# Altium project TSOP1738_BOARD.PrjPcb
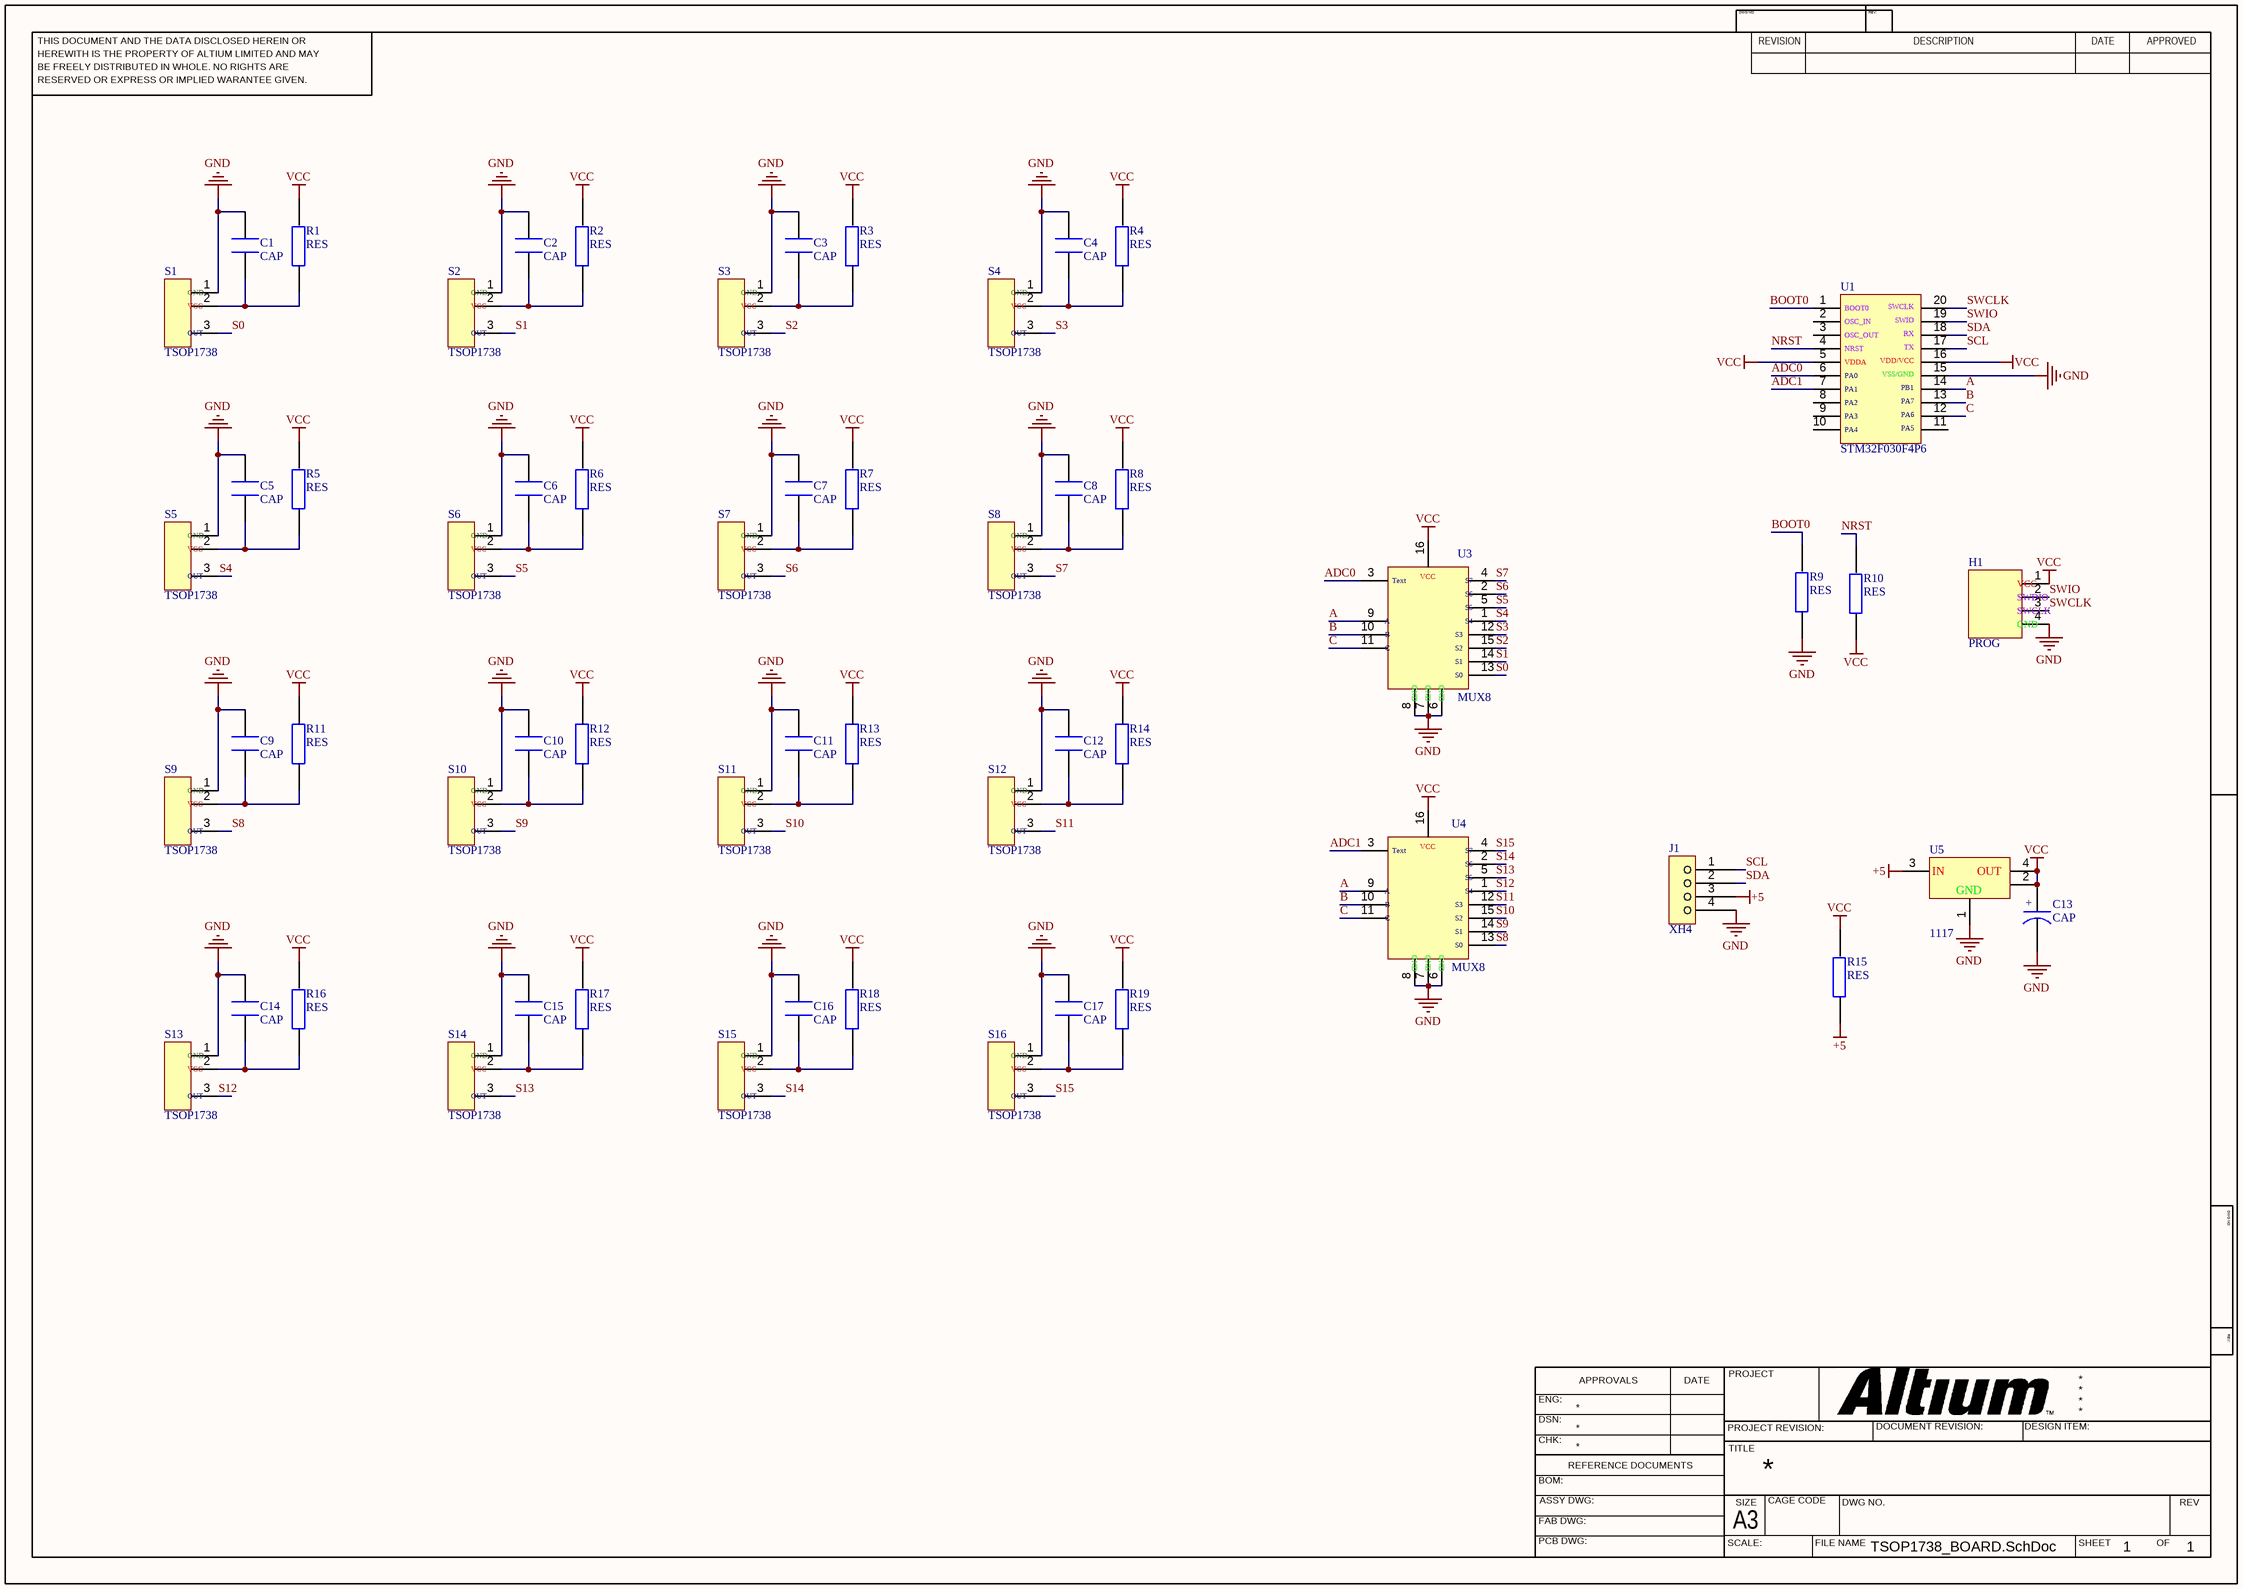
[diagram p0: TSOP1738_BOARD.SchDoc]
1 sheet, 58 parts. Net scope: global (net labels, ports and power ports of the same name join across sheets).
Board file: TSOP1738_BOARD.PcbDoc

## Sheet TSOP1738_BOARD.SchDoc
size 420 x 297 mm; SheetNumber: 1; SheetTotal: 1

### Parts
C1  CAP  [CAP1206]
C2  CAP  [CAP1206]
C3  CAP  [CAP1206]
C4  CAP  [CAP1206]
C5  CAP  [CAP1206]
C6  CAP  [CAP1206]
C7  CAP  [CAP1206]
C8  CAP  [CAP1206]
C9  CAP  [CAP1206]
C10  CAP  [CAP1206]
C11  CAP  [CAP1206]
C12  CAP  [CAP1206]
C13  CAP  [CAP SMD 100uF 16V]
C14  CAP  [CAP1206]
C15  CAP  [CAP1206]
C16  CAP  [CAP1206]
C17  CAP  [CAP1206]
H1  PROG  [PROGRAMER]
J1  XH4  [XH 4PIN]
R1  RES  [RES805]
R2  RES  [RES805]
R3  RES  [RES805]
R4  RES  [RES805]
R5  RES  [RES805]
R6  RES  [RES805]
R7  RES  [RES805]
R8  RES  [RES805]
R9  RES  [RES1206]
R10  RES  [RES1206]
R11  RES  [RES805]
R12  RES  [RES805]
R13  RES  [RES805]
R14  RES  [RES805]
R15  RES  [RES805]
R16  RES  [RES805]
R17  RES  [RES805]
R18  RES  [RES805]
R19  RES  [RES805]
S1  TSOP1738  [TSOP1738]
S2  TSOP1738  [TSOP1738]
S3  TSOP1738  [TSOP1738]
S4  TSOP1738  [TSOP1738]
S5  TSOP1738  [TSOP1738]
S6  TSOP1738  [TSOP1738]
S7  TSOP1738  [TSOP1738]
S8  TSOP1738  [TSOP1738]
S9  TSOP1738  [TSOP1738]
S10  TSOP1738  [TSOP1738]
S11  TSOP1738  [TSOP1738]
S12  TSOP1738  [TSOP1738]
S13  TSOP1738  [TSOP1738]
S14  TSOP1738  [TSOP1738]
S15  TSOP1738  [TSOP1738]
S16  TSOP1738  [TSOP1738]
U1  STM32F030F4P6  [STM32F030F4P6]
U3  MUX8  [4051 SMD]
U4  MUX8  [4051 SMD]
U5  1117  [AMS1117]

### Nets
+5: J1.3 R15.1 U5.3
GND: C1.2 C2.2 C3.2 C4.2 C5.2 C6.2 C7.2 C8.2 C9.2 C10.2 C11.2 C12.2 C13.1 C14.2 C15.2 C16.2 C17.2 H1.4 J1.4 R9.1 S1.1 S2.1 S3.1 S4.1 S5.1 S6.1 S7.1 S8.1 S9.1 S10.1 S11.1 S12.1 S13.1 S14.1 S15.1 S16.1 U1.15 U3.6 U3.7 U3.8 U4.6 U4.7 U4.8 U5.1
VCC: C13.2 H1.1 R1.2 R2.2 R3.2 R4.2 R5.2 R6.2 R7.2 R8.2 R10.1 R11.2 R12.2 R13.2 R14.2 R15.2 R16.2 R17.2 R18.2 R19.2 U1.5 U1.16 U3.16 U4.16 U5.2 U5.4
A: U1.14 U3.9 U4.9
ADC0: U1.6 U3.3
ADC1: U1.7 U4.3
B: U1.13 U3.10 U4.10
BOOT0: R9.2 U1.1
C: U1.12 U3.11 U4.11
NRST: R10.2 U1.4
S0: S1.3 U3.13
S1: S2.3 U3.14
S2: S3.3 U3.15
S3: S4.3 U3.12
S4: S5.3 U3.1
S5: S6.3 U3.5
S6: S7.3 U3.2
S7: S8.3 U3.4
S8: S9.3 U4.13
S9: S10.3 U4.14
S10: S11.3 U4.15
S11: S12.3 U4.12
S12: S13.3 U4.1
S13: S14.3 U4.5
S14: S15.3 U4.2
S15: S16.3 U4.4
SCL: J1.1 U1.17
SDA: J1.2 U1.18
SWCLK: H1.3 U1.20
SWIO: H1.2 U1.19
NetC1_1: C1.1 R1.1 S1.2
NetC2_1: C2.1 R2.1 S2.2
NetC3_1: C3.1 R3.1 S3.2
NetC4_1: C4.1 R4.1 S4.2
NetC5_1: C5.1 R5.1 S5.2
NetC6_1: C6.1 R6.1 S6.2
NetC7_1: C7.1 R7.1 S7.2
NetC8_1: C8.1 R8.1 S8.2
NetC9_1: C9.1 R11.1 S9.2
NetC10_1: C10.1 R12.1 S10.2
NetC11_1: C11.1 R13.1 S11.2
NetC12_1: C12.1 R14.1 S12.2
NetC14_1: C14.1 R16.1 S13.2
NetC15_1: C15.1 R17.1 S14.2
NetC16_1: C16.1 R18.1 S15.2
NetC17_1: C17.1 R19.1 S16.2

Not connected (* = marked no-connect by the designer): U1 2 3 8 9 10 11

### Notes on the sheet
- THIS DOCUMENT AND THE DATA DISCLOSED HEREIN OR
- HEREWITH IS THE PROPERTY OF ALTIUM LIMITED AND MAY
- DWG NO:
- REVISION
- REV:
- DESCRIPTION
- DATE
- APPROVED
- BE FREELY DISTRIBUTED IN WHOLE. NO RIGHTS ARE
- RESERVED OR EXPRESS OR IMPLIED WARANTEE GIVEN.
- ENG:
- APPROVALS
- PROJECT
- DSN:
- CHK:
- REFERENCE DOCUMENTS
- PROJECT REVISION:
- TITLE
- DOCUMENT REVISION:
- DESIGN ITEM:
- BOM:
- FAB DWG:
- PCB DWG:
- ASSY DWG:
- SCALE:
- A3
- SIZE
- CAGE CODE
- FILE NAME
- DWG NO.
- SHEET
- OF
- REV
- (in symbol 4051) VCC; Text; S7; S6; S5; A; S4; B; S3; C; S2; S1; S0; GND
- (in symbol AMS1117) IN; OUT; GND
- (in symbol CAP Electrolit SMD) +
- (in symbol Programmer) VCC; SWDIO; SWCLK; GND
- (in symbol STM32F030F4P6) BOOT0; SWCLK; OSC_IN; SWIO; OSC_OUT; RX; NRST; TX; VDDA; VDD/VCC; PA0; VSS/GND; PA1; PB1; PA2; PA7; PA3; PA6; PA4; PA5
- (in symbol TSOP1738) GND; VCC; OUT

### Library data of the parts
C1-C12 C14-C17 = CAP1206: Capacitor SMD 1206
C13 = CAP Electrolit SMD: Capacitor Electrolit SMD
H1 = Programmer
J1 = XH 4PIN: XH Connector 4pins
R1-R8 R11-R19 = RES805: RESISTOR SMD
R9 R10 = RES1206: RESISTOR SMD
S1-S16 = TSOP1738: IR SENSOR
U3 U4 = 4051: MULTIPLEXER 8 BIT
U5 = AMS1117: 3.3v Regulator